# Altium schematic sheet SLT3-PAY-1Q2T_P5.SchDoc
size A4
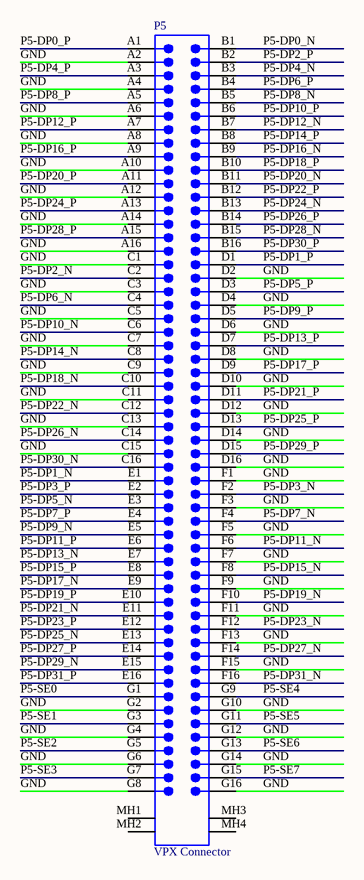
[diagram p0: SLT3-PAY-1Q2T_P5.SchDoc]

## Parts
P5  VPX Connector  [BTB1-8-4H112M]

## Nets
GND: P5.A2 P5.A4 P5.A6 P5.A8 P5.A10 P5.A12 P5.A14 P5.A16 P5.C1 P5.C3 P5.C5 P5.C7 P5.C9 P5.C11 P5.C13 P5.C15 P5.D2 P5.D4 P5.D6 P5.D8 P5.D10 P5.D12 P5.D14 P5.D16 P5.F1 P5.F3 P5.F5 P5.F7 P5.F9 P5.F11 P5.F13 P5.F15 P5.G2 P5.G4 P5.G6 P5.G8 P5.G10 P5.G12 P5.G14 P5.G16
P5-DP0_N: P5.B1
P5-DP0_P: P5.A1
P5-DP1_N: P5.E1
P5-DP1_P: P5.D1
P5-DP2_N: P5.C2
P5-DP2_P: P5.B2
P5-DP3_N: P5.F2
P5-DP3_P: P5.E2
P5-DP4_N: P5.B3
P5-DP4_P: P5.A3
P5-DP5_N: P5.E3
P5-DP5_P: P5.D3
P5-DP6_N: P5.C4
P5-DP6_P: P5.B4
P5-DP7_N: P5.F4
P5-DP7_P: P5.E4
P5-DP8_N: P5.B5
P5-DP8_P: P5.A5
P5-DP9_N: P5.E5
P5-DP9_P: P5.D5
P5-DP10_N: P5.C6
P5-DP10_P: P5.B6
P5-DP11_N: P5.F6
P5-DP11_P: P5.E6
P5-DP12_N: P5.B7
P5-DP12_P: P5.A7
P5-DP13_N: P5.E7
P5-DP13_P: P5.D7
P5-DP14_N: P5.C8
P5-DP14_P: P5.B8
P5-DP15_N: P5.F8
P5-DP15_P: P5.E8
P5-DP16_N: P5.B9
P5-DP16_P: P5.A9
P5-DP17_N: P5.E9
P5-DP17_P: P5.D9
P5-DP18_N: P5.C10
P5-DP18_P: P5.B10
P5-DP19_N: P5.F10
P5-DP19_P: P5.E10
P5-DP20_N: P5.B11
P5-DP20_P: P5.A11
P5-DP21_N: P5.E11
P5-DP21_P: P5.D11
P5-DP22_N: P5.C12
P5-DP22_P: P5.B12
P5-DP23_N: P5.F12
P5-DP23_P: P5.E12
P5-DP24_N: P5.B13
P5-DP24_P: P5.A13
P5-DP25_N: P5.E13
P5-DP25_P: P5.D13
P5-DP26_N: P5.C14
P5-DP26_P: P5.B14
P5-DP27_N: P5.F14
P5-DP27_P: P5.E14
P5-DP28_N: P5.B15
P5-DP28_P: P5.A15
P5-DP29_N: P5.E15
P5-DP29_P: P5.D15
P5-DP30_N: P5.C16
P5-DP30_P: P5.B16
P5-DP31_N: P5.F16
P5-DP31_P: P5.E16
P5-SE0: P5.G1
P5-SE1: P5.G3
P5-SE2: P5.G5
P5-SE3: P5.G7
P5-SE4: P5.G9
P5-SE5: P5.G11
P5-SE6: P5.G13
P5-SE7: P5.G15

Not connected (* = marked no-connect by the designer): P5 MH1 MH2 MH3 MH4

## Library data of the parts
P5 = 2102771-1: Ruggedized Board-to-Board Connector, Right Angle, 7-Row, Pitch 1.8mm, 112-Position; Manufacturer: TE; Bonding: No; ComponentHeigth: 14.7mm; PressFit: No; Case: *; Component Kind: Standard; Component Type: Standard; CreateDate: 2018-01-01; Device: *; Footprint: *; HelpURL: *; LatestRevisionDate: 2018-01-01; Manufacturer Part Number: 2102771-1; Mounted: Yes; PackageDescription: 2102771-1; Part Description: Ruggedized Board-to-Board Connector, Right Angle, 7-Row, Pitch 1.8mm, 112-Position; Part Number: 2102771-1; Pin Count: *; Sense: No; SMD: Yes; Socket: No; Family: VPX Connector